# EAGLE design neonpixelbar (EAGLE 7.1.0)
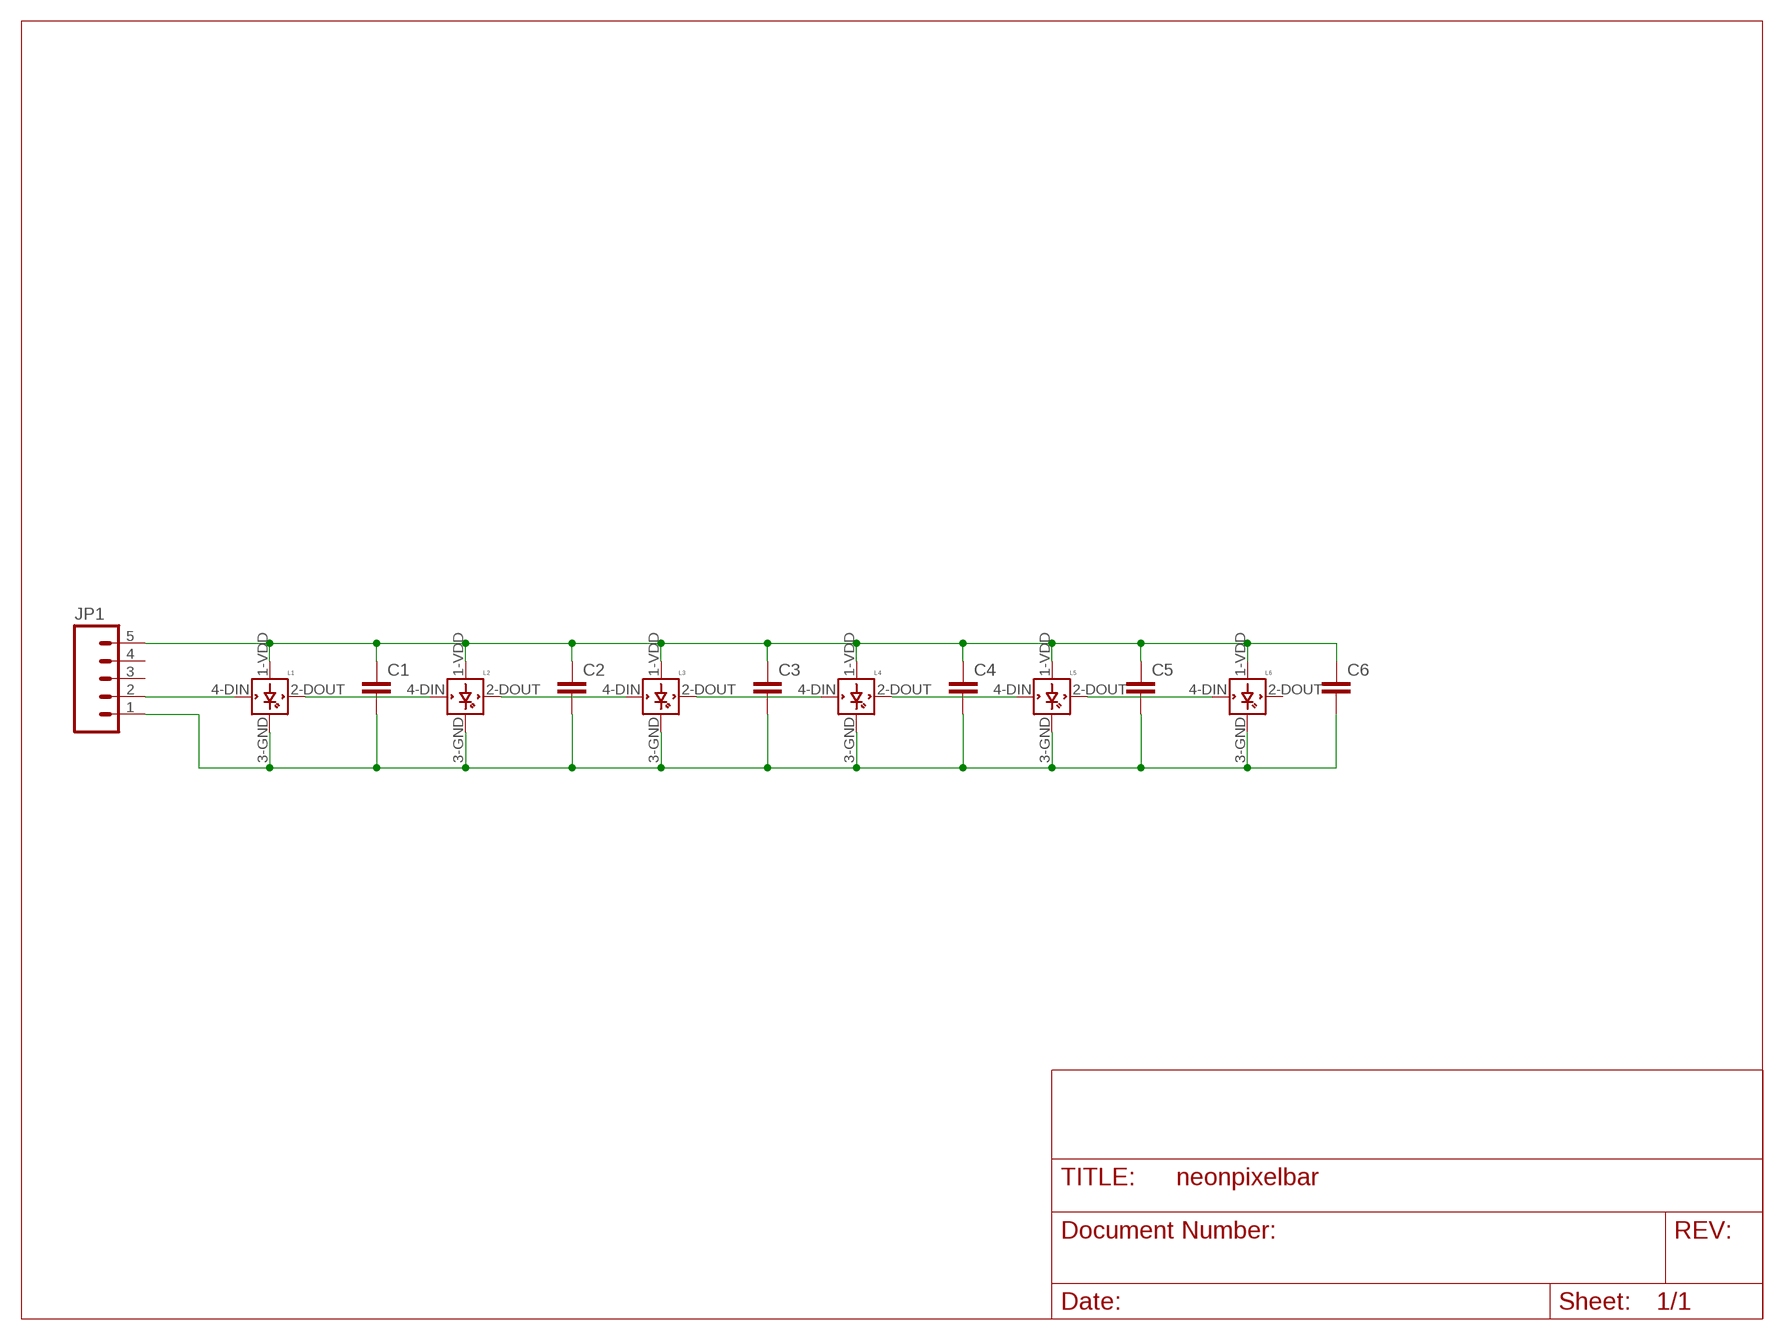
[diagram p0: schematic, sheet 1]

## Parts
C1  CAPPTH3  [CAP-PTH-LARGE]
C2  CAPPTH3  [CAP-PTH-LARGE]
C3  CAPPTH3  [CAP-PTH-LARGE]
C4  CAPPTH3  [CAP-PTH-LARGE]
C5  CAPPTH3  [CAP-PTH-LARGE]
C6  CAPPTH3  [CAP-PTH-LARGE]
JP1  M05PTH_LONGPADS  [1X05_LONGPADS]
L1  WS2812B  [WS2812B]
L2  WS2812B  [WS2812B]
L3  WS2812B  [WS2812B]
L4  WS2812B  [WS2812B]
L5  WS2812B  [WS2812B]
L6  WS2812B  [WS2812B]

## Nets
GND: C1.2 C2.2 C3.2 C4.2 C5.2 C6.2 JP1.1 L1.3-GND(GND) L2.3-GND(GND) L3.3-GND(GND) L4.3-GND(GND) L5.3-GND(GND) L6.3-GND(GND)
N$1: L1.2-DOUT(DOUT) L2.4-DIN(DIN)
N$2: L2.2-DOUT(DOUT) L3.4-DIN(DIN)
N$3: L3.2-DOUT(DOUT) L4.4-DIN(DIN)
N$4: L4.2-DOUT(DOUT) L5.4-DIN(DIN)
N$5: L5.2-DOUT(DOUT) L6.4-DIN(DIN)
N$7: JP1.2 L1.4-DIN(DIN)
VDD: C1.1 C2.1 C3.1 C4.1 C5.1 C6.1 JP1.5 L1.1-VDD(VDD) L2.1-VDD(VDD) L3.1-VDD(VDD) L4.1-VDD(VDD) L5.1-VDD(VDD) L6.1-VDD(VDD)
Unconnected: JP1.3 JP1.4 L6.2-DOUT(DOUT)

## Library data of the parts
C1-C6 = SparkFun-Capacitors:CAP: Capacitor Standard 0603 ceramic capacitor, and 0.1" leaded capacitor.
JP1 = SparkFun-Connectors:M05: Header 5 Standard 5-pin 0.1" header. Use with straight break away headers (SKU : PRT-00116), right angle break away headers (PRT-00553), swiss pins (PRT-00743), machine pins (PRT-00117), and female headers (PRT-00115). Molex polarized connector foot print use with SKU : PRT-08230 with associated crimp pins and housings.
L1-L6 = adafruit:WS2812B

## Board
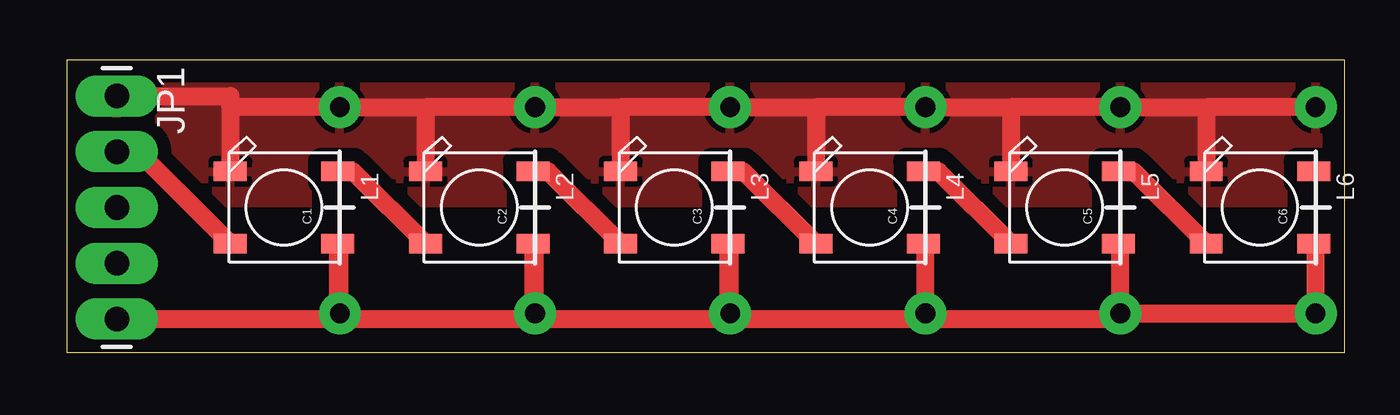
[diagram p1: board, top side]

Size 58.22 x 13.32 mm. Coordinates in mm from the lower left corner, seen from the top.
Outline: 0,0 58.22,0 58.22,13.32 0,13.32 0,0
Copper layers (1*16): Top 0.035mm / dielectric 1.5mm / Bottom 0.035mm
Design rules "default": minimum track width 10mil, minimum drill 24mil, track to track 8mil, track to pad 8mil, pad to pad 8mil, via to via 8mil, smd to smd 8mil, copper to edge 40mil, drill to drill 8mil, minimum pad ring 10mil, minimum via ring 8mil, stop-mask expansion 4mil, vias tented up to drill 0mil, thermal gap 10mil

### Footprints (pad centres in the part's own frame; a part is rotated, then mirrored left to right if it is on the bottom)
CAP-PTH-LARGE = drill 0.9 pad 1.905: 1 -4.826,0; 2 4.572,0
1X05_LONGPADS = drill 1.118 pad 1.88 long: 1 0,0; 2 2.54,0; 3 5.08,0; 4 7.62,0; 5 10.16,0
WS2812B = smd 1.5 x 0.9: 1-VDD 2.45,-1.65; 2-DOUT 2.45,1.65; 3-GND -2.45,1.65; 4-DIN -2.45,-1.65

### Placement (x,y rotation side)
C1  12.45,6.6 90 top
C2  21.34,6.6 90 top
C3  30.23,6.6 90 top
C4  39.12,6.6 90 top
C5  48.01,6.6 90 top
C6  56.9,6.6 90 top
JP1  2.29,11.68 270 top
L1  9.91,6.6 0 top
L2  18.8,6.6 0 top
L3  27.69,6.6 0 top
L4  36.58,6.6 0 top
L5  45.47,6.6 0 top
L6  54.36,6.6 0 top

### Tracks (layer width: path | path; a pad name or v marks a point on that pad's centre or on a via)
GND
  Top 0.813: JP1.1 7.46,11.68 7.46,11.18 | 7.46,11.18 L1.3-GND | 7.46,11.18 C1.2 16.35,11.18 | 16.35,11.18 L2.3-GND | 16.35,11.18 C2.2 25.24,11.18 | 25.24,11.18 L3.3-GND | 25.24,11.18 C3.2 34.13,11.18 | 34.13,11.18 L4.3-GND | 34.13,11.18 C4.2 43.02,11.18 | 43.02,11.18 L5.3-GND | 43.02,11.18 C5.2 51.91,11.18 | 51.91,11.18 L6.3-GND | C6.2 51.91,11.18
  pour Top (isolate 0.61): -0.25,14.22 59.44,14.22 59.44,-0.89 -0.25,-1.02
N$1
  Top 0.813: L1.2-DOUT 13.05,8.25 L2.4-DIN
N$2
  Top 0.813: L2.2-DOUT 21.94,8.25 L3.4-DIN
N$3
  Top 0.813: L3.2-DOUT 30.83,8.25 L4.4-DIN
N$4
  Top 0.813: L4.2-DOUT 39.72,8.25 L5.4-DIN
N$5
  Top 0.813: L5.2-DOUT 48.61,8.25 L6.4-DIN
N$6
  cutout Top: 11.18,7.87 14.99,7.87 14.99,4.06 12.45,4.06 11.18,4.06
N$7
  Top 0.813: JP1.2 3.27,9.14 L1.4-DIN
N$8
  cutout Top: 20.07,7.87 23.88,7.87 23.88,4.06 20.07,4.06
N$9
  cutout Top: 28.96,7.87 32.77,7.87 32.77,4.06 28.96,4.06
N$10
  cutout Top: 37.85,7.87 41.66,7.87 41.66,4.06 37.85,4.06
N$11
  cutout Top: 46.74,7.87 50.55,7.87 50.55,4.06 46.74,4.06
N$12
  cutout Top: 55.63,7.87 55.63,4.06 58.17,4.06 58.17,9.14 55.63,9.14
N$13
  cutout Top: 4.83,6.6 4.83,2.79 58.17,2.79 58.17,6.6
VDD
  Top 0.813: JP1.5 12.19,1.52 C1.1 12.45,4.86 L1.1-VDD 12.36,1.61 12.45,1.52 21.08,1.52 C2.1 21.34,4.86 L2.1-VDD 21.25,1.61 21.34,1.52 29.97,1.52 C3.1 30.23,4.86 L3.1-VDD 30.14,1.61 30.23,1.52 38.86,1.52 C4.1 | C4.1 39.12,1.52 47.75,1.52 C5.1 | C5.1 C6.1 56.9,4.86 L6.1-VDD | C5.1 48.01,4.86 L5.1-VDD | C4.1 39.12,4.86 L4.1-VDD